# Altium schematic sheet ignition_injectors.SchDoc
size A4
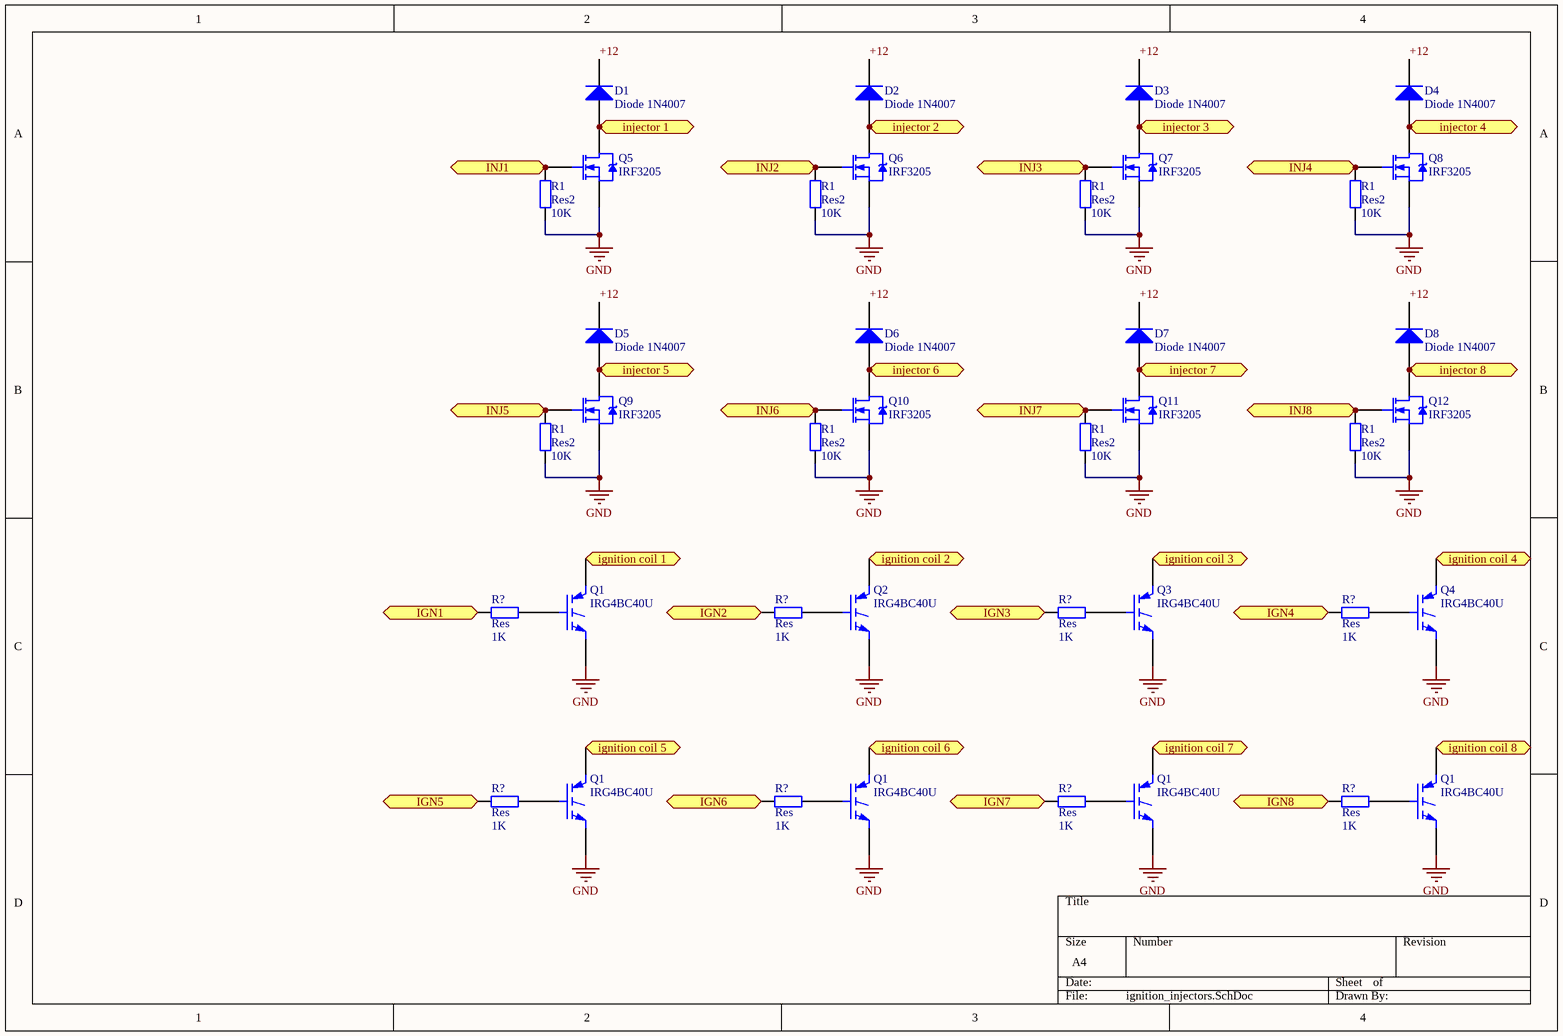
[diagram p0: ignition_injectors.SchDoc]

## Parts
(Parts that share a designator on the sheet are numbered #1, #2 ... from top to bottom, then left to right.)
D1  Diode 1N4007  [DO-41]
D2  Diode 1N4007  [DO-41]
D3  Diode 1N4007  [DO-41]
D4  Diode 1N4007  [DO-41]
D5  Diode 1N4007  [DO-41]
D6  Diode 1N4007  [DO-41]
D7  Diode 1N4007  [DO-41]
D8  Diode 1N4007  [DO-41]
Q1#1  IRG4BC40U  [TO-220AB]
Q1#2  IRG4BC40U  [TO-220AB]
Q1#3  IRG4BC40U  [TO-220AB]
Q1#4  IRG4BC40U  [TO-220AB]
Q1#5  IRG4BC40U  [TO-220AB]
Q2  IRG4BC40U  [TO-220AB]
Q3  IRG4BC40U  [TO-220AB]
Q4  IRG4BC40U  [TO-220AB]
Q5  IRF3205  [TO-220AB]
Q6  IRF3205  [TO-220AB]
Q7  IRF3205  [TO-220AB]
Q8  IRF3205  [TO-220AB]
Q9  IRF3205  [TO-220AB]
Q10  IRF3205  [TO-220AB]
Q11  IRF3205  [TO-220AB]
Q12  IRF3205  [TO-220AB]
R1#1  Res2  value 10K  [AXIAL-0.4]
R1#2  Res2  value 10K  [AXIAL-0.4]
R1#3  Res2  value 10K  [AXIAL-0.4]
R1#4  Res2  value 10K  [AXIAL-0.4]
R1#5  Res2  value 10K  [AXIAL-0.4]
R1#6  Res2  value 10K  [AXIAL-0.4]
R1#7  Res2  value 10K  [AXIAL-0.4]
R1#8  Res2  value 10K  [AXIAL-0.4]
R?#1  Res  value 1K  [1206 resistor]
R?#2  Res  value 1K  [1206 resistor]
R?#3  Res  value 1K  [1206 resistor]
R?#4  Res  value 1K  [1206 resistor]
R?#5  Res  value 1K  [1206 resistor]
R?#6  Res  value 1K  [1206 resistor]
R?#7  Res  value 1K  [1206 resistor]
R?#8  Res  value 1K  [1206 resistor]

## Ports
IGN1 (bidir), IGN2 (bidir), IGN3 (bidir), IGN4 (bidir), IGN5 (bidir), IGN6 (bidir), IGN7 (bidir), IGN8 (bidir), ignition coil 1 (bidir), ignition coil 2 (bidir), ignition coil 3 (bidir), ignition coil 4 (bidir), ignition coil 5 (bidir), ignition coil 6 (bidir), ignition coil 7 (bidir), ignition coil 8 (bidir), INJ1 (bidir), INJ2 (bidir), INJ3 (bidir), INJ4 (bidir), INJ5 (bidir), INJ6 (bidir), INJ7 (bidir), INJ8 (bidir), injector 1 (bidir), injector 2 (bidir), injector 3 (bidir), injector 4 (bidir), injector 5 (bidir), injector 6 (bidir), injector 7 (bidir), injector 8 (bidir)

## Nets
GND: Q1#1.3(E) Q1#2.3(E) Q1#3.3(E) Q1#4.3(E) Q1#5.3(E) Q2.3(E) Q3.3(E) Q4.3(E) Q5.3(S) Q6.3(S) Q7.3(S) Q8.3(S) Q9.3(S) Q10.3(S) Q11.3(S) Q12.3(S) R1#1.1 R1#2.1 R1#3.1 R1#4.1 R1#5.1 R1#6.1 R1#7.1 R1#8.1
+12: D1.2(K) D2.2(K) D3.2(K) D4.2(K) D5.2(K) D6.2(K) D7.2(K) D8.2(K)
IGN1: R?#1.1 ; port IGN1
IGN2: R?#2.1 ; port IGN2
IGN3: R?#3.1 ; port IGN3
IGN4: R?#4.1 ; port IGN4
IGN5: R?#5.1 ; port IGN5
IGN6: R?#6.1 ; port IGN6
IGN7: R?#7.1 ; port IGN7
IGN8: R?#8.1 ; port IGN8
ignition coil 1: Q1#1.2(C) ; port ignition coil 1
ignition coil 2: Q2.2(C) ; port ignition coil 2
ignition coil 3: Q3.2(C) ; port ignition coil 3
ignition coil 4: Q4.2(C) ; port ignition coil 4
ignition coil 5: Q1#2.2(C) ; port ignition coil 5
ignition coil 6: Q1#3.2(C) ; port ignition coil 6
ignition coil 7: Q1#4.2(C) ; port ignition coil 7
ignition coil 8: Q1#5.2(C) ; port ignition coil 8
INJ1: Q5.1(G) R1#1.2 ; port INJ1
INJ2: Q6.1(G) R1#2.2 ; port INJ2
INJ3: Q7.1(G) R1#3.2 ; port INJ3
INJ4: Q8.1(G) R1#4.2 ; port INJ4
INJ5: Q9.1(G) R1#5.2 ; port INJ5
INJ6: Q10.1(G) R1#6.2 ; port INJ6
INJ7: Q11.1(G) R1#7.2 ; port INJ7
INJ8: Q12.1(G) R1#8.2 ; port INJ8
injector 1: D1.1(A) Q5.2(D) ; port injector 1
injector 2: D2.1(A) Q6.2(D) ; port injector 2
injector 3: D3.1(A) Q7.2(D) ; port injector 3
injector 4: D4.1(A) Q8.2(D) ; port injector 4
injector 5: D5.1(A) Q9.2(D) ; port injector 5
injector 6: D6.1(A) Q10.2(D) ; port injector 6
injector 7: D7.1(A) Q11.2(D) ; port injector 7
injector 8: D8.1(A) Q12.2(D) ; port injector 8
NetQ1#1_1: Q1#1.1(G) R?#1.2
NetQ1#2_1: Q1#2.1(G) R?#5.2
NetQ1#3_1: Q1#3.1(G) R?#6.2
NetQ1#4_1: Q1#4.1(G) R?#7.2
NetQ1#5_1: Q1#5.1(G) R?#8.2
NetQ2_1: Q2.1(G) R?#2.2
NetQ3_1: Q3.1(G) R?#3.2
NetQ4_1: Q4.1(G) R?#4.2

## Library data of the parts
D1-D8 = Diode 1N4007: 1 Amp General Purpose Rectifier; Published: 8-Jun-2000; LatestRevisionDate: 17-Jul-2002; LatestRevisionNote: Re-released for DXP Platform.; DatasheetVersion: 1998; PackageVersion: Aug-1999; PackageReference: DO-41; Publisher: Altium Limited; PackageDescription: Diode, Axial; Body 5.2 x 2.7 mm (LxDia. max), Lead Dia. 0.86 mm (max); Code_JEDEC: DO-204-AL; ComponentLink1Description: Manufacturer Link; ComponentLink1URL: http://www.fairchildsemi.com/; ComponentLink2Description: Datasheet; ComponentLink2URL: http://www.fairchildsemi.com/ds/1N%2F1N4001.pdf
Q1#1-Q1#5 Q2-Q4 = IRG4BC40U: Insulated Gate Bipolar Transistor; Published: 8-Jun-2000; LatestRevisionDate: 17-Jul-2002; LatestRevisionNote: Re-released for DXP Platform.; DatasheetVersion: Apr-1997; PackageVersion: Feb-1997; PackageReference: TO-220AB; Publisher: Altium Limited; PackageDescription: TO, Thru-Hole, Vertical, Heatsink Mounted; 3 In-Line Leads; Pitch 2.54 mm; ComponentLink1Description: Manufacturer Link; ComponentLink1URL: http://www.irf.com/; ComponentLink2Description: Datasheet; ComponentLink2URL: http://www.irf.com/product-info/datasheets/data/irg4bc40u.pdf
Q5-Q12 = IRF3205: HEXFET Power MOSFET; Note: Pin 2 is electrically connected to pin 4.; Published: 8-Jun-2000; LatestRevisionDate: 17-Jul-2002; LatestRevisionNote: Re-released for DXP Platform.; DatasheetVersion: Aug-1997; PackageVersion: Feb-1997; PackageReference: TO-220AB; Publisher: Altium Limited; PackageDescription: TO, Thru-Hole, Vertical, Heatsink Mounted; 3 In-Line Leads; Pitch 2.54 mm; ComponentLink1Description: Manufacturer Link; ComponentLink1URL: http://www.irf.com/; ComponentLink2Description: Datasheet; ComponentLink2URL: http://www.irf.com/product-info/datasheets/data/irf3205.pdf
R1#1-R1#8 = Res2: Resistor; Published: 8-Jun-2000; LatestRevisionDate: 17-Jul-2002; LatestRevisionNote: Re-released for DXP Platform.; PackageReference: AXIAL-0.4; Publisher: Altium Limited; PackageDescription: Axial Device, Thru-Hole; 2 Leads; 0.4 in Pin Spacing